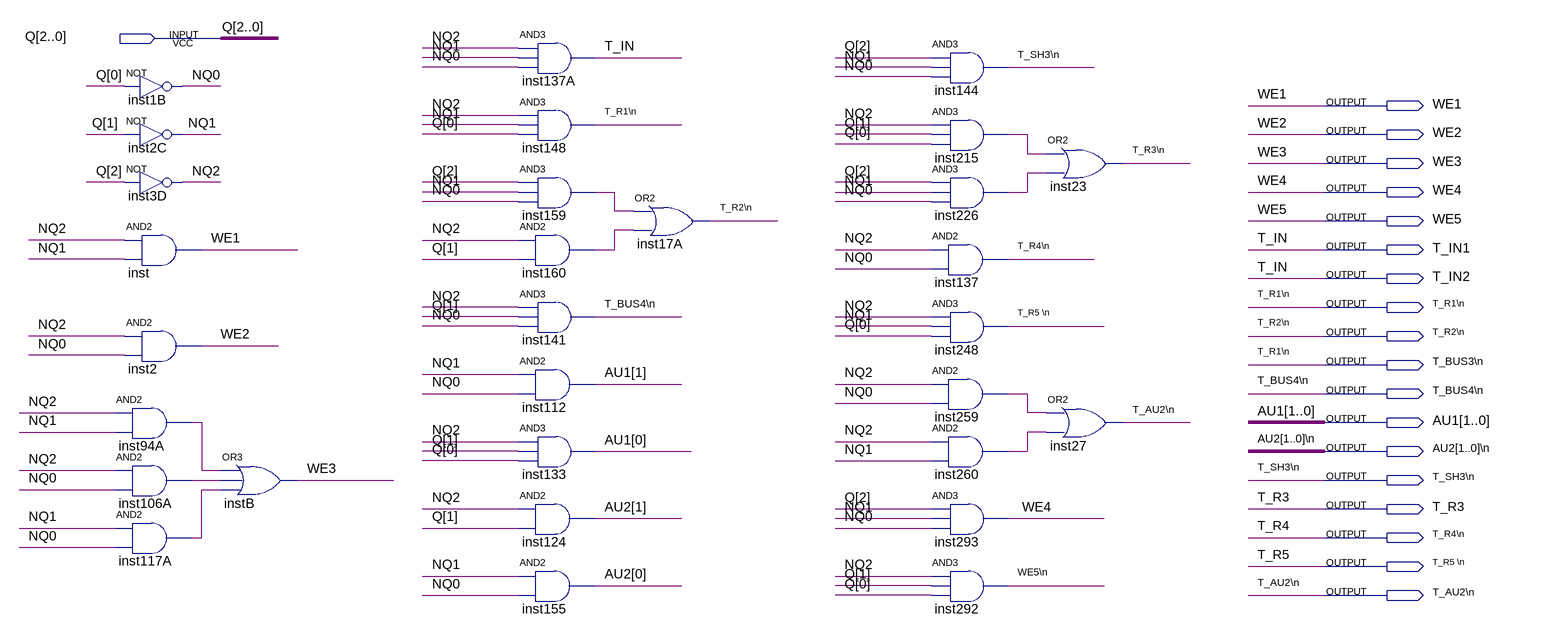
[diagram p0: schematic sheet]
// Quartus schematic controller2.bdf as structural Verilog: 30 symbols, 19 pins
module controller2 (
  input  [2:0] Q,
  output WE1,
  output WE2,
  output WE3,
  output WE4,
  output WE5,
  output T_IN1,
  output T_IN2,
  output \T_R1\n ,
  output \T_R2\n ,
  output \T_BUS3\n ,
  output \T_BUS4\n ,
  output [1:0] AU1,
  output \AU2[1..0]\n ,
  output \T_SH3\n ,
  output T_R3,
  output \T_R4\n ,
  output \T_R5_\n ,
  output \T_AU2\n 
);

  wire inst94A_out, inst106A_out, inst117A_out, inst159_out, inst160_out, inst215_out, inst226_out,
       inst259_out, inst260_out, NQ0, NQ1, NQ2, \T_R3\n , \WE5\n ;
  wire [1:0] AU2;

  not inst1B (NQ0, Q[0]);
  not inst2C (NQ1, Q[1]);
  not inst3D (NQ2, Q[2]);
  and inst (WE1, NQ2, NQ1);
  and inst2 (WE2, NQ2, NQ0);
  and inst94A (inst94A_out, NQ2, NQ1);
  and inst106A (inst106A_out, NQ2, NQ0);
  and inst117A (inst117A_out, NQ1, NQ0);
  or instB (WE3, inst94A_out, inst106A_out, inst117A_out);
  and inst137A (T_IN1, NQ2, NQ1, NQ0);
  and inst148 (\T_BUS3\n , NQ2, NQ1, Q[0]);
  and inst159 (inst159_out, Q[2], NQ1, NQ0);
  and inst160 (inst160_out, NQ2, Q[1]);
  and inst141 (\T_BUS4\n , NQ2, Q[1], NQ0);
  and inst112 (AU1[1], NQ1, NQ0);
  and inst133 (AU1[0], NQ2, Q[1], Q[0]);
  and inst124 (AU2[1], NQ2, Q[1]);
  and inst155 (AU2[0], NQ1, NQ0);
  or inst17A (\T_R2\n , inst159_out, inst160_out);
  and inst144 (\T_SH3\n , Q[2], NQ1, NQ0);
  and inst215 (inst215_out, NQ2, Q[1], Q[0]);
  and inst226 (inst226_out, Q[2], NQ1, NQ0);
  and inst137 (\T_R4\n , NQ2, NQ0);
  and inst248 (\T_R5_\n , NQ2, NQ1, Q[0]);
  and inst259 (inst259_out, NQ2, NQ0);
  and inst260 (inst260_out, NQ2, NQ1);
  and inst293 (WE4, Q[2], NQ1, NQ0);
  and inst292 (\WE5\n , NQ2, Q[1], Q[0]);
  or inst23 (\T_R3\n , inst215_out, inst226_out);
  or inst27 (\T_AU2\n , inst259_out, inst260_out);

  assign T_IN2 = T_IN1;
  assign \T_R1\n  = \T_BUS3\n ;

  // Other names for the same wires on the sheet: T_IN = T_IN1; T_R4 = \T_R4\n ; T_R5 = \T_R5_\n 
endmodule
